# EAGLE design SmartStepp_v2 (EAGLE 8.2.2)
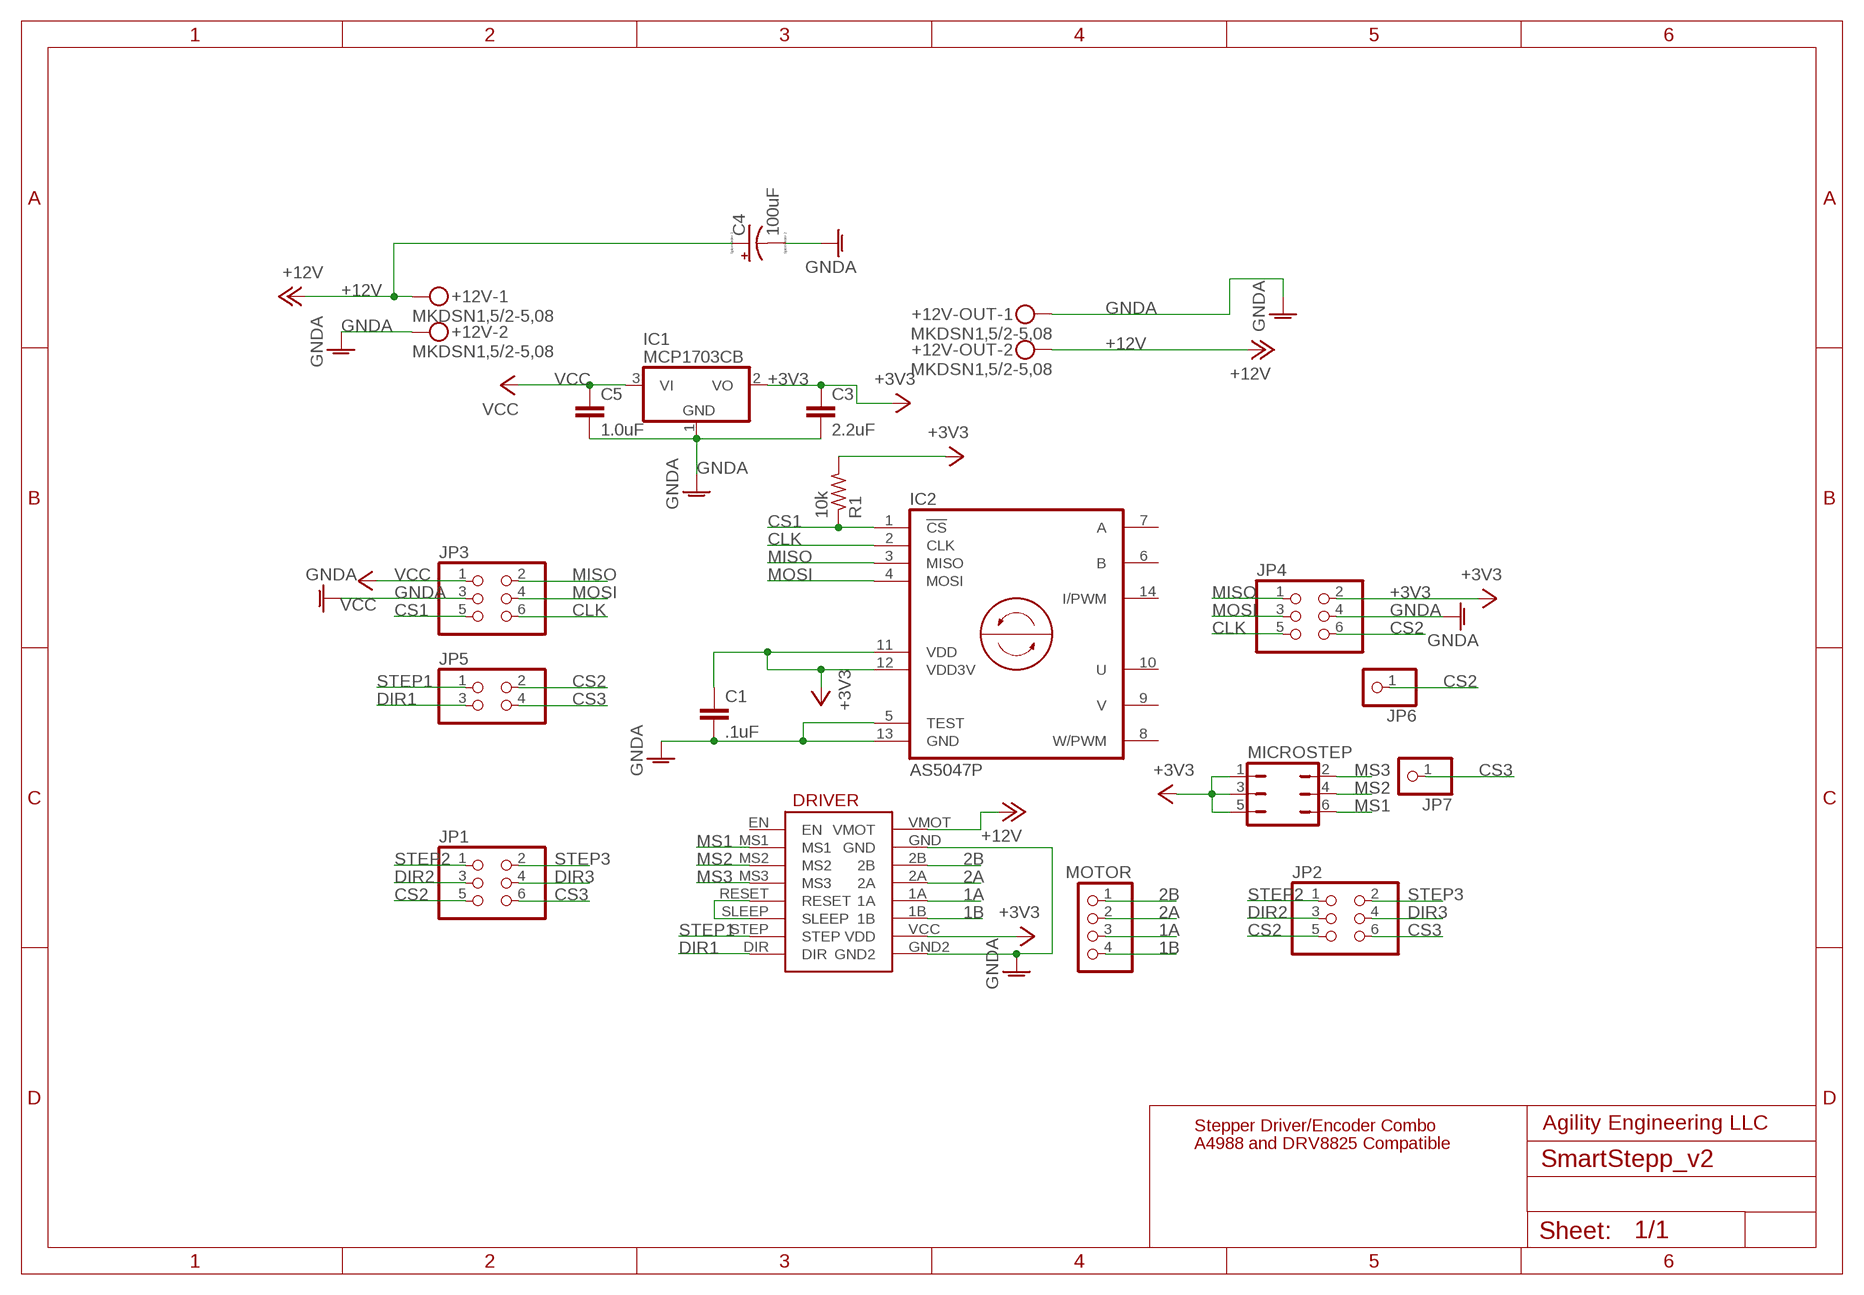
[diagram p0: schematic, sheet 1]

## Parts
+12V  MKDSN1,5/2-5,08  [MKDSN1,5/2-5,08]
+12V-OUT  MKDSN1,5/2-5,08  [MKDSN1,5/2-5,08]
C1  .1uF  C-EUC0805  [C0805]
C3  2.2uF  C-EUC0805  [C0805]
C4  100uF  CPOL-US153CLV-0605  [153CLV-0605]
C5  1.0uF  C-EUC0805  [C0805]
DRIVER  A4988  [MOTOR_DRIVER]
IC1  MCP1703CB  [SOT23]
IC2  AS5047P  [TSSOP14]
JP1  PINHD-2X3  [2X03]
JP2  PINHD-2X3  [2X03]
JP3  PINHD-2X3  [2X03]
JP4  PINHD-2X3  [2X03]
JP5  PINHD-2X2  [2X02]
JP6  PINHD-1X1  [1X01]
JP7  PINHD-1X1  [1X01]
MICROSTEP  JP3Q  [JP3Q]
MOTOR  PINHD-1X4  [1X04]
R1  10k  R-US_R0805  [R0805]

## Nets
1A: DRIVER.1A MOTOR.3
1B: DRIVER.1B MOTOR.4
2A: DRIVER.2A MOTOR.2
2B: DRIVER.2B MOTOR.1
+3V3: C1.1 C3.1 DRIVER.VCC(VDD) IC1.2(VO) IC2.11(VDD) IC2.12(VDD3V) JP4.2 MICROSTEP.1 MICROSTEP.3 MICROSTEP.5 R1.2
+12V: +12V-OUT.2 +12V.1 C4.+ DRIVER.VMOT
CLK: IC2.2(CLK) JP3.6 JP4.5
CS1: IC2.1(!CS!) JP3.5 R1.1
CS2: JP1.5 JP2.5 JP4.6 JP5.2 JP6.1
CS3: JP1.6 JP2.6 JP5.4 JP7.1
DIR1: DRIVER.DIR JP5.3
DIR2: JP1.3 JP2.3
DIR3: JP1.4 JP2.4
GNDA: +12V-OUT.1 +12V.2 C1.2 C3.2 C4.- C5.2 DRIVER.GND DRIVER.GND2 IC1.1(GND) IC2.5(TEST) IC2.13(GND) JP3.3 JP4.4
MISO: IC2.3(MISO) JP3.2 JP4.1
MOSI: IC2.4(MOSI) JP3.4 JP4.3
MS1: DRIVER.MS1 MICROSTEP.6
MS2: DRIVER.MS2 MICROSTEP.4
MS3: DRIVER.MS3 MICROSTEP.2
N$1: DRIVER.RESET DRIVER.SLEEP
STEP1: DRIVER.STEP JP5.1
STEP2: JP1.1 JP2.1
STEP3: JP1.2 JP2.2
VCC: C5.1 IC1.3(VI) JP3.1
Unconnected: DRIVER.EN IC2.6(B) IC2.7(A) IC2.8(W/PWM) IC2.9(V) IC2.10(U) IC2.14(I/PWM)

## Notes on the sheet
- Stepper Driver/Encoder Combo | Agility Engineering LLC
- A4988 and DRV8825 Compatible

## Library data of the parts
+12V +12V-OUT = con-phoenix-508:MKDSN1,5/2-5,08: MKDSN 1,5/ 2-5,08 Printklemme Nennstrom: 13,5 A Nennspannung: 250 V Rastermaß: 5,08 mm Polzahl: 2 Anschlussart: Schraubanschluss Montage: Löten Anschlussrichtung Leiter/Platine: 0 ° Artikelnummer: 1729128 Source: http://eshop.phoenixcontact.com .. 1729128.pdf
C1 C3 C5 = resistor:C-EU: CAPACITOR, European symbol
C4 = resistor:CPOL-US: POLARIZED CAPACITOR, American symbol
DRIVER = Personal:A4988
IC1 = linear:MCP1703: 250 mA, 16V, Low Quiescent Current LDO Regulator Source: http://ww1.microchip.com/downloads/en/DeviceDoc/22049b.pdf
IC2 = ams:AS5047: ROTARY ENCODER 14-bit On-Axis Magnetic Rotary Position Sensor 12-Bit Decimal & Binary Incremental Pulse Count 28krpm high speed capability
JP1-JP4 = pinhead:PINHD-2X3: PIN HEADER
JP5 = pinhead:PINHD-2X2: PIN HEADER
JP6 JP7 = pinhead:PINHD-1X1: PIN HEADER
MICROSTEP = jumper:JP3Q: JUMPER
MOTOR = pinhead:PINHD-1X4: PIN HEADER
R1 = resistor:R-US_: RESISTOR, American symbol

## Board
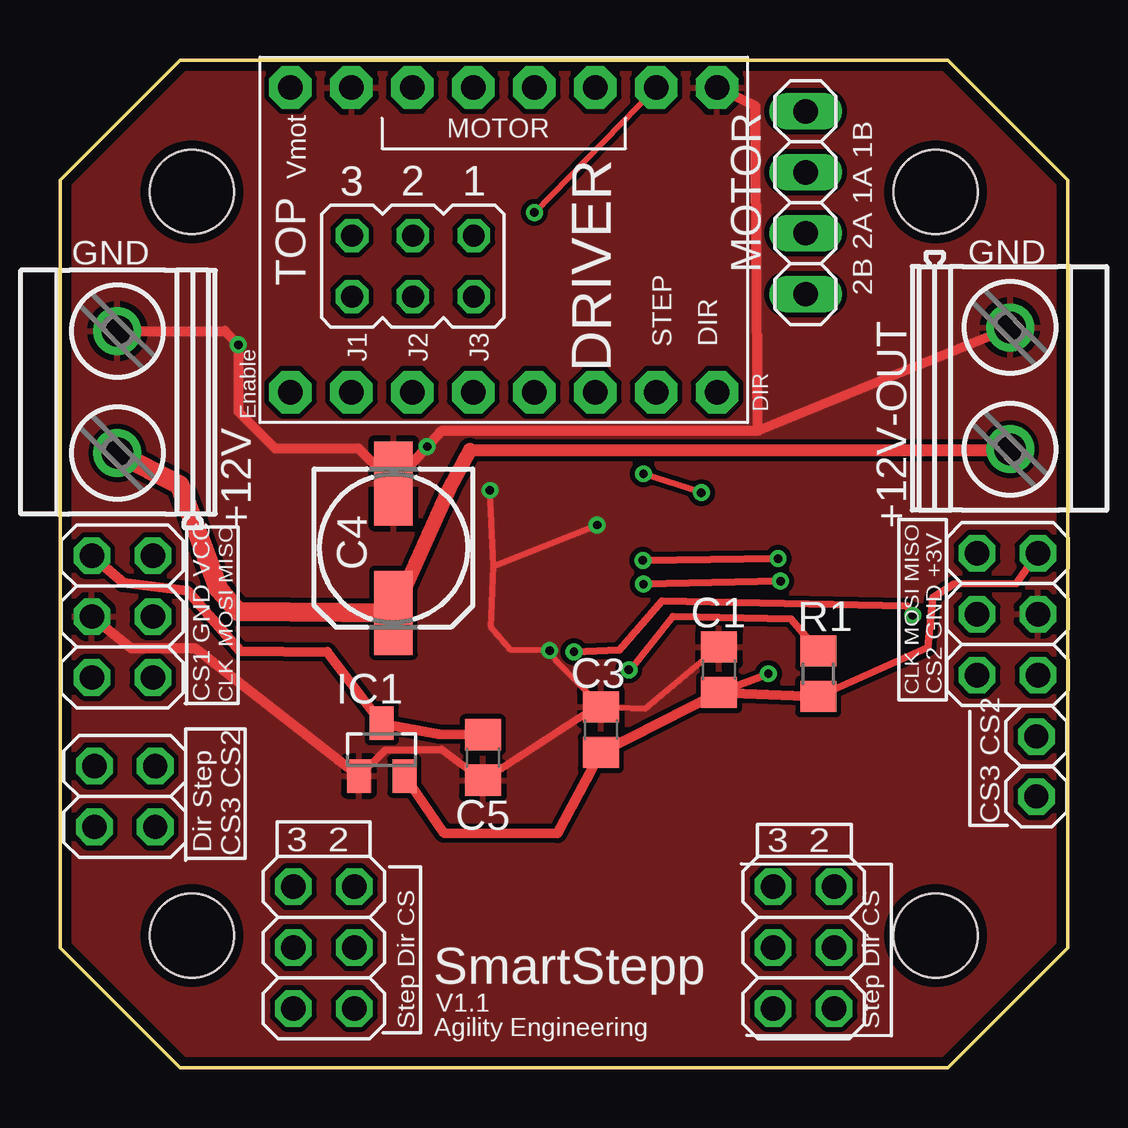
[diagram p1: board, top side]
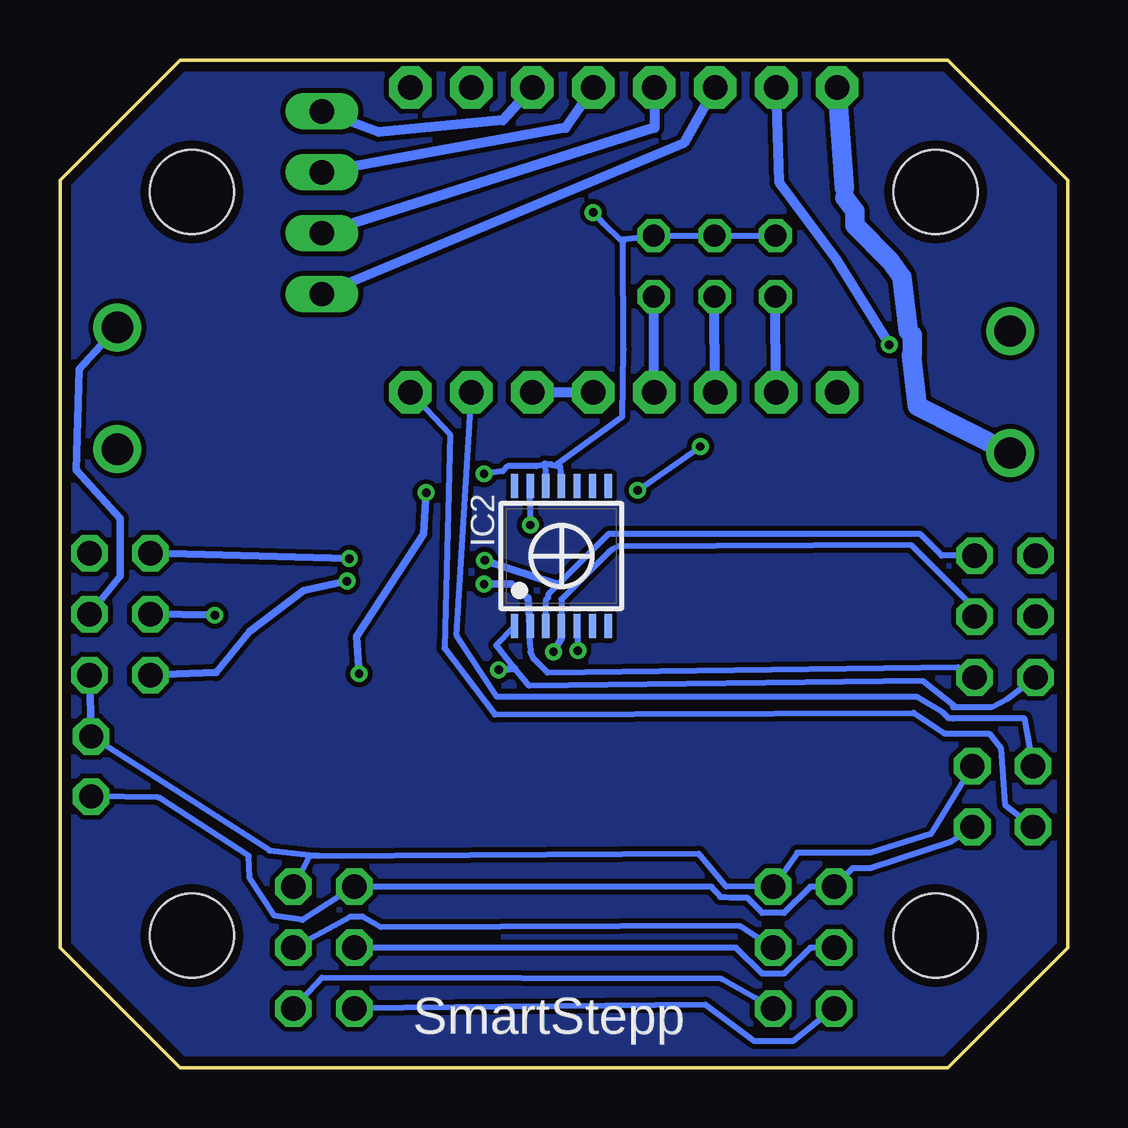
[diagram p2: board, bottom side, seen from below]

Size 42 x 42 mm. Coordinates in mm from the lower left corner, seen from the top.
Outline: 5,0 37,0 42,5 42,37 37,42 5,42 0,37 0,5 5,0
Copper layers (1*16): Top 0.0356mm / dielectric 1.5011mm / Bottom 0.0356mm
Design rules "OSH-PCBOrder *": minimum track width 6mil, minimum drill 13mil, track to track 8mil, track to pad 8mil, pad to pad 8mil, via to via 8mil, smd to smd 6mil, copper to edge 15mil, drill to drill 6mil, minimum pad ring 7mil, minimum via ring 7mil, stop-mask expansion 3mil, vias tented up to drill 0mil, thermal gap 10mil
Holes 3.5 mm at 5.5,36.5 36.5,36.5 5.5,5.5 36.5,5.5

### Footprints (pad centres in the part's own frame; a part is rotated, then mirrored left to right if it is on the bottom)
MKDSN1,5/2-5,08 = drill 1.3 pad 2: 1 -2.561,0.025; 2 2.519,0.025
C0805 = smd 1.3 x 1.5: 1 -0.95,0; 2 0.95,0
153CLV-0605 = smd 3.5 x 1.6: + 2.7,0; - -2.7,0
MOTOR_DRIVER = drill 1.016 pad 1.778 octagon: 1A 6.35,-1.27; 1B 6.35,-3.81; 2A 6.35,1.27; 2B 6.35,3.81; DIR -6.35,-8.89; EN -6.35,8.89; GND 6.35,6.35; GND2 6.35,-8.89; MS1 -6.35,6.35; MS2 -6.35,3.81; MS3 -6.35,1.27; RESET -6.35,-1.27; SLEEP -6.35,-3.81; STEP -6.35,-6.35; VCC 6.35,-6.35; VMOT 6.35,8.89
SOT23 = smd 1 x 1.4: 1 -0.95,-1.1; 2 0.95,-1.1; 3 0,1.1
TSSOP14 = smd 0.305 x 0.991: 1 -1.95,-2.918; 2 -1.3,-2.918; 3 -0.65,-2.918; 4 0,-2.918; 5 0.65,-2.918; 6 1.3,-2.918; 7 1.95,-2.918; 8 1.95,2.918; 9 1.3,2.918; 10 0.65,2.918; 11 0,2.918; 12 -0.65,2.918; 13 -1.3,2.918; 14 -1.95,2.918
2X03 = drill 1.016 octagon: 1 -2.54,-1.27; 2 -2.54,1.27; 3 0,-1.27; 4 0,1.27; 5 2.54,-1.27; 6 2.54,1.27
2X02 = drill 1.016 octagon: 1 -1.27,-1.27; 2 -1.27,1.27; 3 1.27,-1.27; 4 1.27,1.27
1X01 = drill 1.016 octagon: 1 0,0
JP3Q = drill 0.914 octagon: 1 -2.54,-1.27; 2 -2.54,1.27; 3 0,-1.27; 4 0,1.27; 5 2.54,-1.27; 6 2.54,1.27
1X04 = drill 1.016 long: 1 -3.81,0; 2 -1.27,0; 3 1.27,0; 4 3.81,0
R0805 = smd 1.3 x 1.5: 1 -0.95,0; 2 0.95,0

### Placement (x,y rotation side)
+12V  2.42,28.18 90 top
+12V-OUT  39.58,28.29 270 top
C1  27.47,16.58 90 top
C3  22.55,14.08 90 top
C4  13.9,21.65 270 top
C5  17.63,12.93 270 top
DRIVER  18.5,34.5 90 top
IC1  13.41,13.25 0 top
IC2  21.1,21.32 0 bottom
JP1  11,5 90 top
JP2  31,5 90 top
JP3  2.6,18.8 270 top
JP4  39.5,18.9 270 top
JP5  2.7,11.3 270 top
JP6  40.7,13.8 90 top
JP7  40.7,11.3 90 top
MICROSTEP  14.71,33.41 180 top
MOTOR  31.08,36.05 90 top
R1  31.61,16.42 270 top

### Tracks (layer width: path | path; a pad name or v marks a point on that pad's centre or on a via)
1A
  Bottom 0.406: DRIVER.1A 20.92,39.17 MOTOR.3
1B
  Bottom 0.406: DRIVER.1B 23.54,39.48 28.72,39 MOTOR.4
2A
  Bottom 0.406: DRIVER.2A 17.21,39.17 MOTOR.2
2B
  Bottom 0.406: DRIVER.2B 15.99,38.54 MOTOR.1
+3V3  (via drill 0.35)
  Top 0.254: v26.74,23.96 v24.32,24.75 | v19.78,35.64 DRIVER.VCC
  Top 0.305: R1.2 36.19,17.51 36.39,19.59 37.25,20.15 39.87,20.18 JP4.2 | C1.1 v29.53,16.42
  Top 0.406: IC1.2 15.99,9.79 20.74,9.76 C3.1 C1.1 R1.2
  Bottom 0.254: 21.78,25.18 21.52,25.15 22.15,25.06 23.34,25.06 23.53,24.87 23.53,24.86 v24.32,24.75 | 21.78,25.18 IC2.12 | 21.78,25.18 21.36,25.09 | 21.36,25.09 21.15,25.05 IC2.11 | 21.36,25.09 18.56,27.13 18.51,29.93 18.53,34.4 | 18.53,34.4 18.53,34.53 MICROSTEP.1 MICROSTEP.3 MICROSTEP.5 | 18.53,34.4 19.4,35.24 v19.78,35.64
  Bottom 0.305: v29.53,16.42 29.63,17.96 26.84,22.23 v26.74,23.96
+12V
  Top 0.406: 6.62,19.95 6.77,19.78 | 39.49,25.74 +12V-OUT.2
  Top 0.508: 17.08,25.74 39.49,25.74
  Top 0.61: C4.+ 16.25,24.16 17.08,25.74
  Top 0.813: +12V.1 4.98,24.27 6.62,19.95 | 6.77,19.78 7.42,19.01 C4.+
  Bottom 0.406: 9.28,36.27 9.31,36.68 | 9.6,40.68 DRIVER.VMOT
  Bottom 0.813: +12V.1 6.26,27.57 6.51,29.69 6.47,29.73 6.47,30.53 6.63,30.69 6.9,32.95 7.38,33.62 8.86,35.11 8.86,35.69 9.28,36.27 | 9.31,36.68 9.6,40.68
CLK  (via drill 0.35)
  Top 0.305: v24.32,20.15 v30.04,20.28
  Bottom 0.254: IC2.2 22.4,17.64 22.39,17.33 22.27,17.05 21.68,16.47 4.55,16.7 JP3.6
  Bottom 0.305: IC2.2 22.49,19.57 23.18,20.15 v24.32,20.15 | v30.04,20.28 31.84,19.9 34.1,18.17 35.5,16.47 JP4.5
CS1  (via drill 0.35)
  Top 0.305: R1.1 30.47,18.7 25.54,18.8 23.76,16.54 v23.71,16.58
  Bottom 0.254: JP3.5 2.53,15.35 3.16,15.02 4.64,15.02 | 4.64,15.02 4.77,15.02 | 4.64,15.02 6.04,16.11 22.44,15.91 23.05,16.64 23.81,17.61 IC2.1
  Bottom 0.305: v23.71,16.58 23.05,16.64
CS2
  Bottom 0.254: JP5.2 5.7,9.74 8.22,8.95 11.27,8.95 JP1.5 14.24,7.55 15.38,8.92 31.24,8.82 | 31.24,8.82 31.59,8.82 JP2.5 | JP6.1 33.26,9.05 31.24,8.82
  Bottom 0.305: JP6.1 JP4.6
CS3
  Bottom 0.254: JP5.4 4.84,9.43 8.22,8.31 8.96,8.31 JP1.6 10.73,7.54 11.82,6.45 12.72,6.45 13.35,7.07 14.09,7.08 14.26,7.09 14.43,7.09 14.45,7.11 14.47,7.11 14.58,7.24 14.7,7.36 14.84,7.54 JP2.6 31.89,6.15 33.06,6.33 34.1,7.91 34.13,8.82 37.89,11.26 JP7.1
DIR1
  Bottom 0.254: DRIVER.DIR 25.74,26.4 25.97,17.48 23.87,14.71 6.42,14.79 5.12,13.93 3.27,13.93 2.78,13.32 2.61,10.95 JP5.3
DIR2
  Bottom 0.254: JP1.3 13.68,5.9 28.62,5.85 29.38,6.28 29.89,6.28 JP2.3
DIR3
  Bottom 0.254: JP1.4 10.73,5 11.82,3.91 12.72,3.91 13.81,5 JP2.4
GNDA  (via drill 0.35)
  Top 0.254: 18.08,20.91 17.97,18.35 18.79,17.41 v20.41,17.38 20.72,16.91 22.47,15.11 C3.2 24.4,14.97 C1.2 | 18.08,20.91 v22.39,22.61 | 18.08,20.91 v17.92,24.06
  Top 0.305: IC1.1 13.55,13.22 15.92,13.27 C5.2 22.47,15.11
  Top 0.406: +12V.2 6.86,30.7 v7.43,30.13 7.43,27.34 8.96,25.81 12.44,25.81 C4.- v15.3,25.88 15.92,26.55 29.1,26.55 | 29.1,26.55 +12V-OUT.1 | 29.1,26.55 29,40.06 DRIVER.GND2 | JP3.3 2.96,17.48 5.63,17.48 IC1.1
  Bottom 0.254: IC2.5 v20.41,17.38 | v22.39,22.61 IC2.13 | v17.92,24.06 15.87,25.48 v15.3,25.88
  Bottom 0.305: JP4.4 39.49,20.48 39.49,22.89 41.32,24.9 41.19,29.12 +12V-OUT.1
  Bottom 0.406: DRIVER.GND 12.03,36.91 9.62,33.66 7.46,30.18 v7.43,30.13
  pour Top: 0,37 5,42 37,42 42,37 42,5 37,0 5,0 0,5
MISO  (via drill 0.35)
  Top 0.305: v29.94,21.22 v24.3,21.14
  Bottom 0.254: JP3.2 5.24,21.34 6.16,22.26 19.12,22.26 21.24,20.13 21.66,19.72 21.66,19.59 21.76,19.49 IC2.3
  Bottom 0.305: JP4.1 v29.94,21.22 | v24.3,21.14 21.24,20.13
MOSI  (via drill 0.35)
  Top 0.305: v21.43,17.33 23.33,17.41 25.09,19.44 35.3,19.23 v35.55,18.85
  Bottom 0.254: JP3.4 3.87,19.13 6.52,21.77 18.73,21.73 18.99,21.6 19.12,21.5 21.1,19.52 IC2.4
  Bottom 0.305: IC2.4 21.12,17.86 v21.43,17.33 | v35.55,18.85 JP4.3
MS1
  Bottom 0.406: DRIVER.MS1 MICROSTEP.6
MS2
  Bottom 0.406: DRIVER.MS2 MICROSTEP.4
MS3
  Bottom 0.406: DRIVER.MS3 MICROSTEP.2
N$1
  Bottom 0.406: DRIVER.SLEEP DRIVER.RESET
N$2
  pour Bottom: 0.12,5.44 0.12,4.58 4.87,-0.17 37.07,-0.17 37.15,-0.09 37.15,0.08 41.98,4.91 41.98,36.99 41.77,37.19 41.65,37.19 36.9,41.94 4.99,41.94 0.04,36.99 0.04,5.52
STEP1
  Bottom 0.254: JP5.1 1.79,14.54 4.77,14.54 4.8,14.56 4.95,14.56 5.19,14.8 6.29,15.45 23.79,15.45 25.47,18.02 DRIVER.STEP
STEP2
  Bottom 0.254: JP1.1 14.42,3.69 31.08,3.74 JP2.1
STEP3
  Bottom 0.254: JP1.2 11.45,1.1 13.05,1.1 15.1,2.62 JP2.2
VCC
  Top 0.406: JP3.1 2.63,20.23 5.3,19.9 7.51,17.36 11.14,17.33 IC1.3 15.79,13.9 C5.1

### Text on the board
tPlace: GND | GND | 2B 2A 1A 1B | Enable | DIR | CLK MOSI MISO | CS2 GND +3V | CS1 GND VCC | CLK MOSI MISO | CS3 CS2 | Dir Step | CS3 CS2 | 3 2 | 3 2 | SmartStepp | V1.1 | Step Dir CS | Step Dir CS | Agility Engineering
bPlace: SmartStepp